# EasyEDA Pro project bipedwheel.eprj

# Schematic Schematic1
Board Name: Board1; Create Date: 2025-10-13; Page Name: P1; Project Name: bipedwheel; Schematic Name: Schematic1; Update Date: 2026-01-09; Company: 嘉立创EDA; Page Size: A4; Version: V1.0
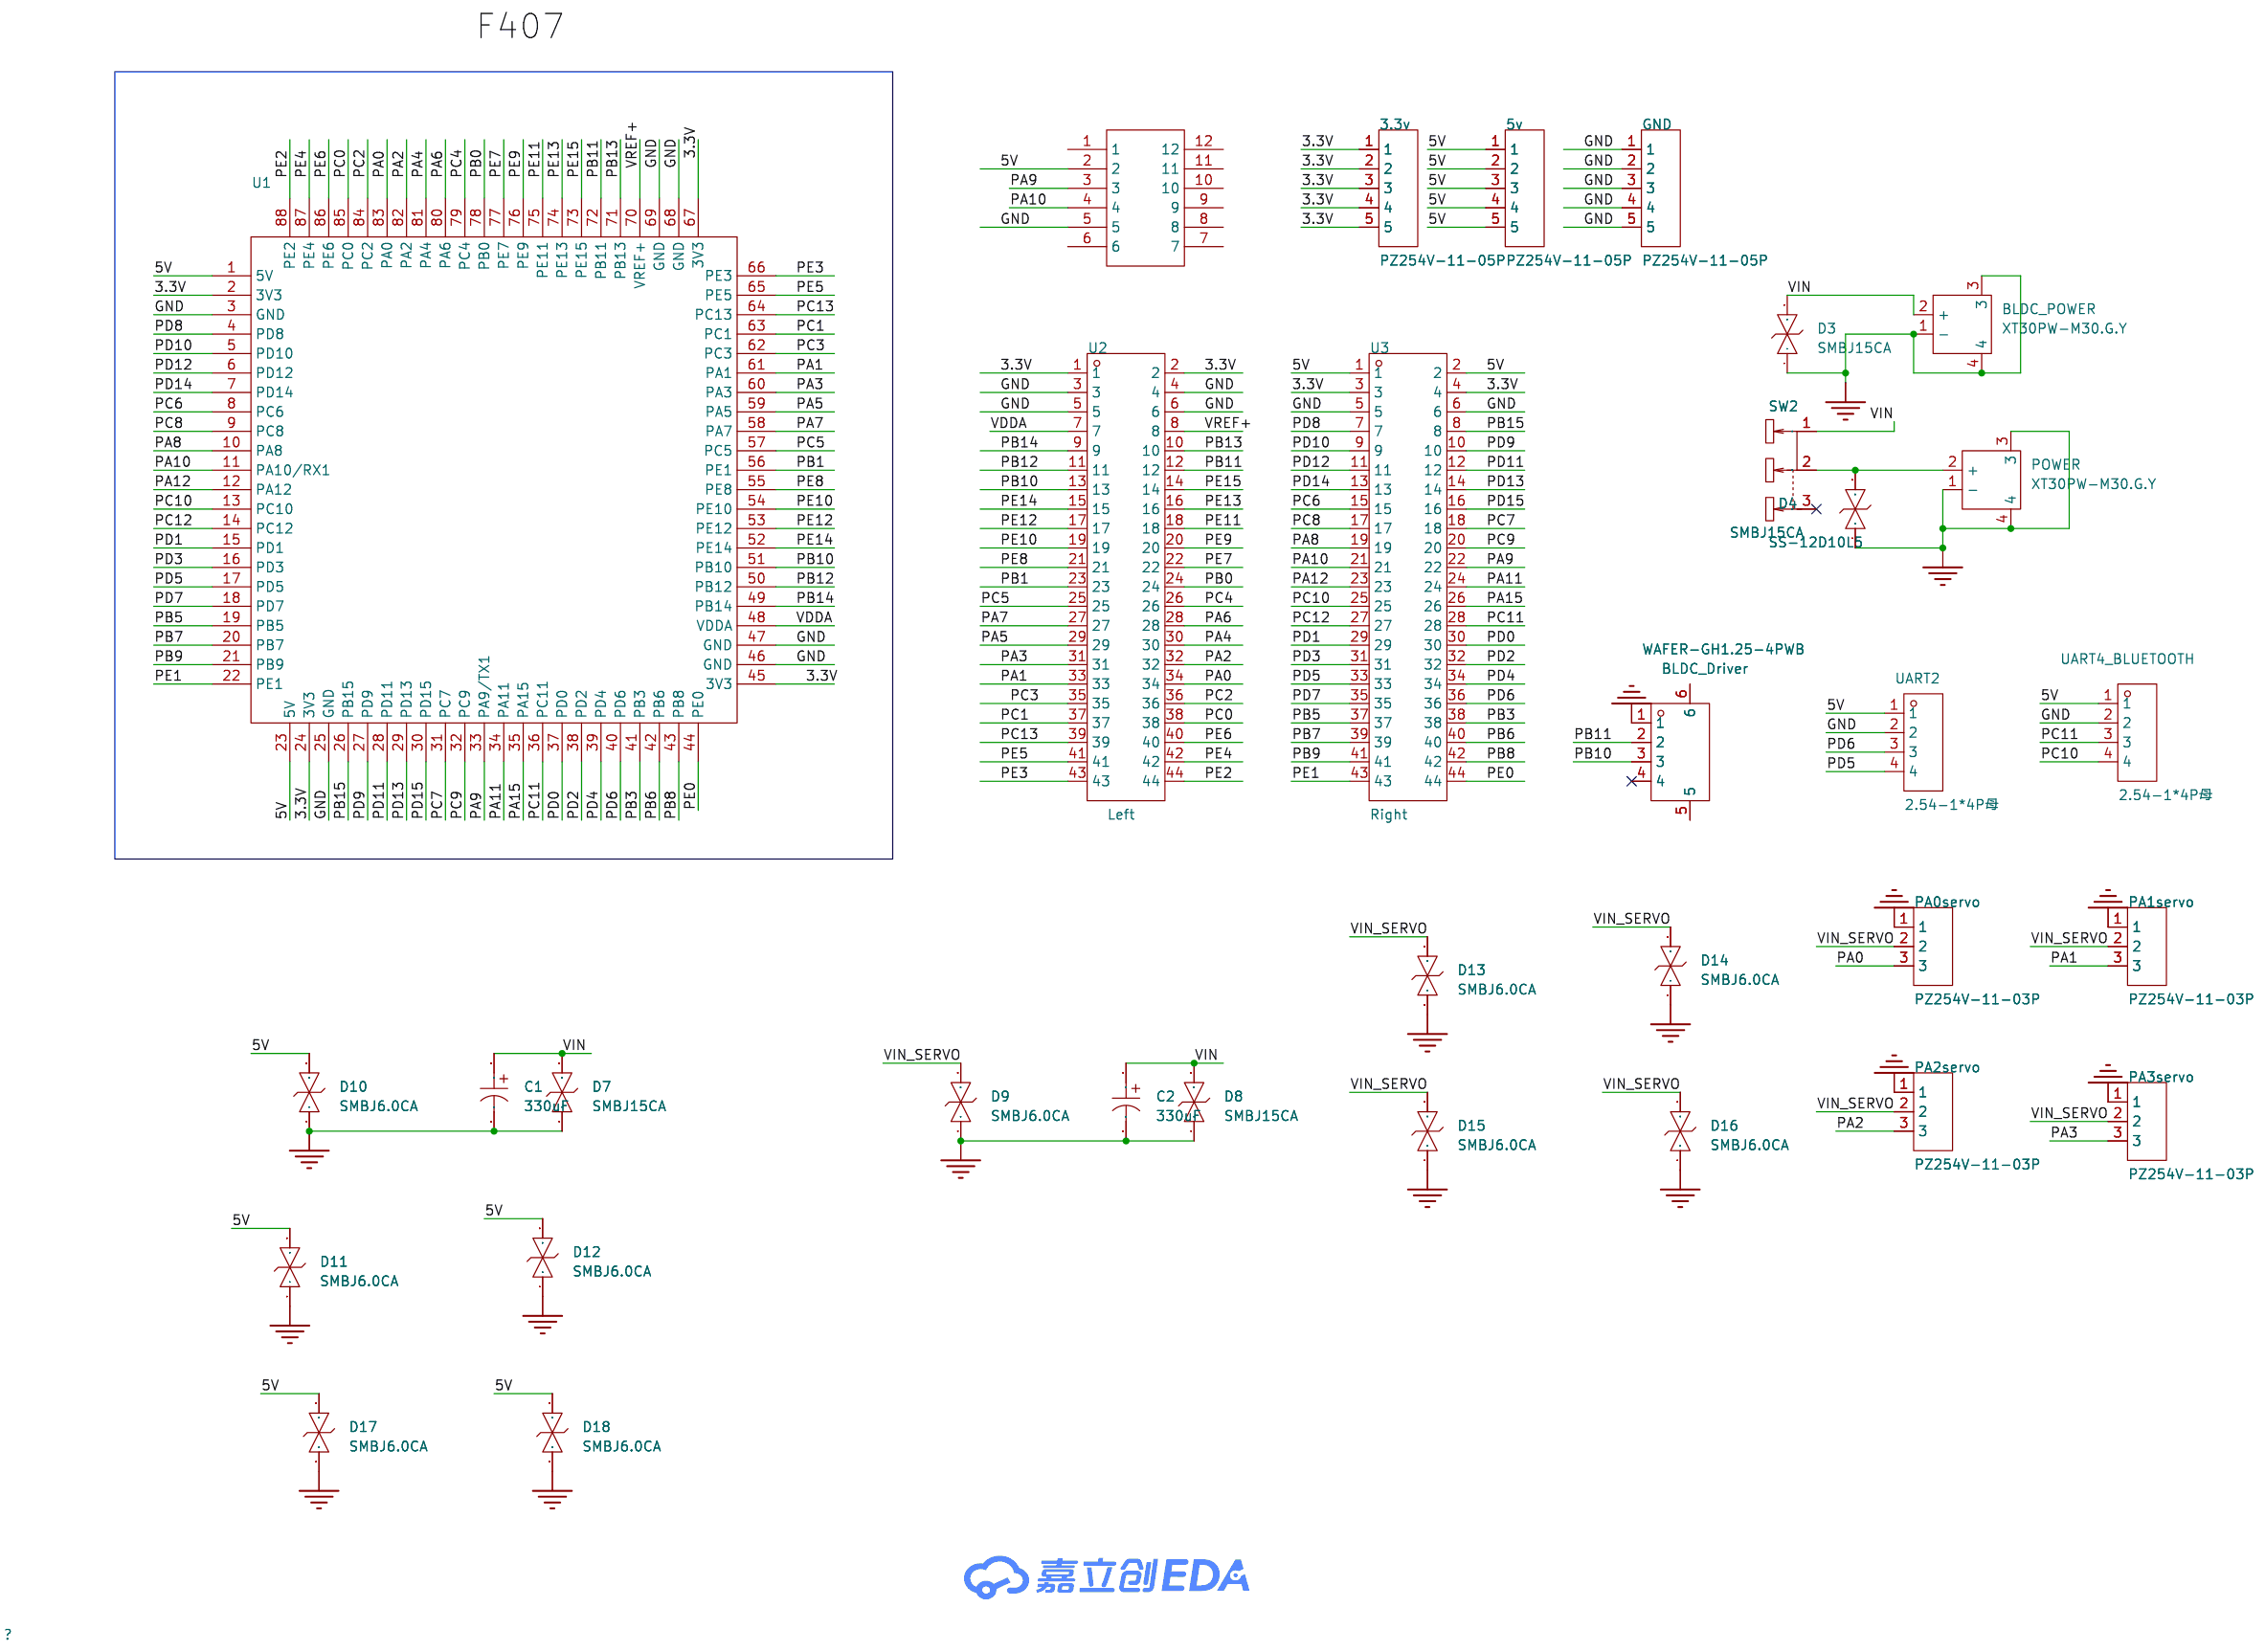
[diagram p0: schematic sheet]

## Parts
3.3v  PZ254V-11-05P  [HDR-TH_5P-P2.54-V-M]
5v  PZ254V-11-05P  [HDR-TH_5P-P2.54-V-M]
BLDC_Driver  WAFER-GH1.25-4PWB  [CONN-SMD_4P-P1.25_XUNPU_WAFER-GH1.25-4PWB]
BLDC_POWER  XT30PW-M30.G.Y  [CONN-TH_XT30PW-M]
C1  330uF  [CAP-SMD_BD6.3-L6.6-W6.6-LS7.3-FD]
C2  330uF  [CAP-SMD_BD6.3-L6.6-W6.6-LS7.3-FD]
D3  SMBJ15CA  [SMB_L4.6-W3.6-LS5.4-BI]
D4  SMBJ15CA  [SMB_L4.6-W3.6-LS5.4-BI]
D7  SMBJ15CA  [SMB_L4.6-W3.6-LS5.4-BI]
D8  SMBJ15CA  [SMB_L4.6-W3.6-LS5.4-BI]
D9  SMBJ6.0CA  [SMB_L4.6-W3.6-LS5.4-BI]
D10  SMBJ6.0CA  [SMB_L4.6-W3.6-LS5.4-BI]
D11  SMBJ6.0CA  [SMB_L4.6-W3.6-LS5.4-BI]
D12  SMBJ6.0CA  [SMB_L4.6-W3.6-LS5.4-BI]
D13  SMBJ6.0CA  [SMB_L4.6-W3.6-LS5.4-BI]
D14  SMBJ6.0CA  [SMB_L4.6-W3.6-LS5.4-BI]
D15  SMBJ6.0CA  [SMB_L4.6-W3.6-LS5.4-BI]
D16  SMBJ6.0CA  [SMB_L4.6-W3.6-LS5.4-BI]
D17  SMBJ6.0CA  [SMB_L4.6-W3.6-LS5.4-BI]
D18  SMBJ6.0CA  [SMB_L4.6-W3.6-LS5.4-BI]
GND  PZ254V-11-05P  [HDR-TH_5P-P2.54-V-M]
JY901S  -  [JY901S_插件]
PA0servo  PZ254V-11-03P  [HDR-TH_3P-P2.54-V-M]
PA1servo  PZ254V-11-03P  [HDR-TH_3P-P2.54-V-M]
PA2servo  PZ254V-11-03P  [HDR-TH_3P-P2.54-V-M]
PA3servo  PZ254V-11-03P  [HDR-TH_3P-P2.54-V-M]
POWER  XT30PW-M30.G.Y  [CONN-TH_XT30PW-M]
SW2  SS-12D10L5  [SW-TH_SS-12D10L5]
U1  -  [STM32F4XX最小系统板]
U2  Left  [HDR-TH_44P-P2.54-V-F-R2-C22-S2.54]
U3  Right  [HDR-TH_44P-P2.54-V-F-R2-C22-S2.54]
UART2  2.54-1*4P母  [HDR-TH_4P-P2.54-V-F]
UART4_BLUETOOTH  2.54-1*4P母  [HDR-TH_4P-P2.54-V-F]

## Library data of the parts
3.3v 5v GND = PZ254V-11-05P: LCSC Part Name: 1x5P 间距:2.54mm 方针 直插; Supplier Part: C492404; Manufacturer: XFCN(兴飞); Supplier Footprint: 插件,P=2.54mm; JLCPCB Part Class: 扩展库; Datasheet: https://atta.szlcsc.com/upload/public/pdf/source/20200309/C492404_E51533260F8710EFF5D4617281164C1D.pdf; Supplier: LCSC; Pin Structure: 1x5P; Pitch: 2.54mm; Circluar Pins/Square Pins: 方针; Mounting Type: 直插; Number of Rows: 单排; Number of Pins: 5P; Length of Mating Pin: 6mm; Insulation Height: 2.5mm; Length of End Connection Pin: 3mm; Contact Material: 黄铜; Operating Temperature: -40℃~+105℃; Color: 黑色
BLDC_Driver = WAFER-GH1.25-4PWB: LCSC Part Name: 1x4P 间距:1.25mm 卧贴 系列:GH; Supplier Part: C3029379; Manufacturer: XUNPU(讯普); Supplier Footprint: SMD,P=1.25mm,卧贴; JLCPCB Part Class: 扩展库; Datasheet: https://item.szlcsc.com/datasheet/WAFER-GH1.25-4PWB/3561391.html; Supplier: LCSC; Pins Structure: 1x4P; Pitch: 1.25mm; Mounting Type: 卧贴; Reference Series: GH; Number of Pins: 4P; Number of Rows: 1; Number of PINs Per Row: 4; Current Rating: 1A; Contact Material: 黄铜; Contact Plating: 锡; Operating Temperature: -25℃~+85℃; Voltage Rating: 125V; Plastic Material: LCP; Supplementary Features: 辅助焊脚; Color: 米色; Z-Height of the Board: 4.35mm; X-Length of Bottom Edge on Board (Spacing Line): 8.25mm; Y-Width of Bottom Edge on Board: 5mm
BLDC_POWER POWER = XT30PW-M30.G.Y: LCSC Part Name: AMASS(艾迈斯)航模插头 卧式弯脚 XT30PW-M公头; Supplier Part: C431092; Manufacturer: AMASS(艾迈斯); JLCPCB Part Class: 扩展库; Datasheet: https://item.szlcsc.com/datasheet/XT30PW-M30.G.Y/426930.html; Supplier: LCSC; Type: 航模插头; RatedVoltage: DC 500V; InterfaceType: 公头; RatedCurrent: 15A; RecommendedWireGauge: 16/18/20AWG; contact resistance: 1.2mΩ; specifications: 2pin
C1 C2 = JVJ25V330M6x8: LCSC Part Name: 330uF ±20% 25V; Supplier Part: C46550406; Manufacturer: JIERR(捷而瑞); Supplier Footprint: SMD,D6.3xL7.7mm; JLCPCB Part Class: 扩展库; Datasheet: https://item.szlcsc.com/datasheet/JVJ25V330M6x8/48680100.html; Supplier: LCSC; Tolerance: ±20%; Voltage Rating: 25V; Ripple Current: 200mA@120Hz; Diameter: 6.3mm; Height - Seated (Max): 7.7mm; Lifetime: 2000hrs@105℃; Operating Temperature: -55℃~+105℃
D3 D4 D7 D8 = SMBJ15CA_C19077570: LCSC Part Name: 双向TVS 15V截止 峰值浪涌电流：24.59A@10/1000us; Supplier Part: C19077570; Manufacturer: R+O(宏嘉诚); Supplier Footprint: DO-214AA(SMB); JLCPCB Part Class: Extended Part; Datasheet: https://item.szlcsc.com/datasheet/SMBJ15CA/20275655.html; Supplier: LCSC; Polarity: 双向; Reverse Stand-Off Voltage (Vrwm): 15V; Clamping Voltage: 24.4V; Peak Pulse Current (Ipp): 24.59A@10/1000us; Peak Pulse Power Dissipation (Ppp): 600W@10/1000us; Voltage - Breakdown: 18.5V; Reverse Leakage Current (Ir): 5uA; Operating Temperature: -55℃~+150℃; level of protection: IEC 61000-4-2; Type: TVS
D9-D18 = SMBJ6.0CA_C19077561: LCSC Part Name: 双向TVS 6V截止 峰值浪涌电流：58.25A@10/1000us; Supplier Part: C19077561; Manufacturer: R+O(宏嘉诚); Supplier Footprint: DO-214AA(SMB); JLCPCB Part Class: 扩展库; Datasheet: https://item.szlcsc.com/datasheet/SMBJ6.0CA/20275646.html; Supplier: LCSC; Polarity: 双向; Reverse Stand-Off Voltage (Vrwm): 6V; Clamping Voltage: 10.3V; Peak Pulse Current (Ipp): 58.25A@10/1000us; Peak Pulse Power Dissipation (Ppp): 600W@10/1000us; Voltage - Breakdown: 7.37V; Reverse Leakage Current (Ir): 800uA; Number of Channels: 单路; level of protection: IEC 61000-4-2; Type: TVS
JY901S = JY901S_插件
PA0servo PA1servo PA2servo PA3servo = PZ254V-11-03P: LCSC Part Name: 1x3P 间距:2.54mm 方针 直插; Supplier Part: C2937625; Manufacturer: XFCN(兴飞); Supplier Footprint: 插件,P=2.54mm; JLCPCB Part Class: 扩展库; Datasheet: https://item.szlcsc.com/datasheet/PZ254V-11-03P/3293280.html; Supplier: LCSC; Pin Structure: 1x3P; Pitch: 2.54mm; Circluar Pins/Square Pins: 方针; Mounting Type: 直插; Number of Rows: 单排; Number of Pins: 3P; Current Rating: 3A; Voltage Rating (Max): 250V; Length of Mating Pin: 6mm; Insulation Height: 2.5mm; Length of End Connection Pin: 3mm; Operating Temperature: -40℃~+105℃; Color: 黑色
SW2 = SS-12D10L5: LCSC Part Name: 柄长5mm 直插双档 滑动开关; Supplier Part: C319012; Manufacturer: XKB Connection(中国星坤); Supplier Footprint: 插件,13x6.8mm; JLCPCB Part Class: 扩展库; Datasheet: https://item.szlcsc.com/datasheet/SS-12D10L5/300104.html; Supplier: LCSC; Circuit: 单刀双掷; Actuator Style: 矩形柱状; Termination Style: PC引脚; Length: 13mm; Width: 6.8mm; Switch Height: 6.4mm; Mounting Type: 直插; Actuator Color: 黑色; Current Rating: 3A; Voltage Rating: 125V; Life: 1万次; Operating Temperature: -40℃~+85℃
U1 = STM32F4xx 最小系统板
U2 U3 = X6521FV-2x22-C85D32: LCSC Part Name: 间距:2.54mm 2x22P 直插; Supplier Part: C2883995; Manufacturer: XKB Connection(中国星坤); Supplier Footprint: 插件,P=2.54mm; JLCPCB Part Class: 扩展库; Datasheet: https://item.szlcsc.com/datasheet/X6521FV-2x22-C85D32/3094487.html; Supplier: LCSC; Holes Structure: 2x22P; Pitch: 2.54mm; Row Spacing: 2.54mm; Circular Hole / Square Hole: 方孔; Mounting Type: 直插; Number of Rows: 双排; Number of Positions: 44P; Current Rating: 3A; Voltage Rating (Max): 250V; Holes Direction: 顶部; Insulation Height: 8.5mm; Contact Material: 黄铜; Contact Plating: 金; Operating Temperature: -40℃~+105℃
UART2 UART4_BLUETOOTH = 2.54-1*4P母: LCSC Part Name: 间距:2.54mm 1x4P 直插; Supplier Part: C2718488; Manufacturer: BOOMELE(博穆精密); Supplier Footprint: 插件,P=2.54mm; JLCPCB Part Class: 扩展库; Datasheet: https://item.szlcsc.com/datasheet/2.54-1*4P%25E6%25AF%258D/2834502.html; Supplier: LCSC; Holes Structure: 1x4P; Pitch: 2.54mm; Circular Hole / Square Hole: 方孔; Mounting Type: 直插; Number of Rows: 单排; Number of Positions: 4P; Current Rating: 3A; Holes Direction: 顶部; Contact Material: 青铜; Operating Temperature: -40℃~+105℃

## Nets
3.3V: 3.3v.1 3.3v.2 3.3v.3 3.3v.4 3.3v.5 U1.2(3V3) U1.24(3V3) U1.45(3V3) U1.67(3V3) U2.1 U2.2 U3.3 U3.4
5V: 5v.1 5v.2 5v.3 5v.4 5v.5 D10.2 D11.2 D12.2 D17.2 D18.2 JY901S.2 U1.1(5V) U1.23(5V) U3.1 U3.2 UART2.1 UART4_BLUETOOTH.1
GND: BLDC_Driver.1 BLDC_POWER.1(-) BLDC_POWER.3 BLDC_POWER.4 C1.2 C2.2 D3.1 D4.1 D7.1 D8.1 D9.1 D10.1 D11.1 D12.1 D13.1 D14.1 D15.1 D16.1 D17.1 D18.1 GND.1 GND.2 GND.3 GND.4 GND.5 JY901S.5 PA0servo.1 PA1servo.1 PA2servo.1 PA3servo.1 POWER.1(-) POWER.3 POWER.4 U1.3(GND) U1.25(GND) U1.46(GND) U1.47(GND) U1.68(GND) U1.69(GND) U2.3 U2.4 U2.5 U2.6 U3.5 U3.6 UART2.2 UART4_BLUETOOTH.2
VDDA: U1.48(VDDA) U2.7
VIN: BLDC_POWER.2(+) C1.1 C2.1 D3.2 D7.2 D8.2 SW2.1
VIN_SERVO: D9.2 D13.2 D14.2 D15.2 D16.2 PA0servo.2 PA1servo.2 PA2servo.2 PA3servo.2
PA0: PA0servo.3 U1.83(PA0) U2.34
PA1: PA1servo.3 U1.61(PA1) U2.33
PA2: PA2servo.3 U1.82(PA2) U2.32
PA3: PA3servo.3 U1.60(PA3) U2.31
PA4: U1.81(PA4) U2.30
PA5: U1.59(PA5) U2.29
PA6: U1.80(PA6) U2.28
PA7: U1.58(PA7) U2.27
PA8: U1.10(PA8) U3.19
PA9: JY901S.3 U1.33(PA9/TX1) U3.22
PA10: JY901S.4 U1.11(PA10/RX1) U3.21
PA11: U1.34(PA11) U3.24
PA12: U1.12(PA12) U3.23
PA15: U1.35(PA15) U3.26
PB0: U1.78(PB0) U2.24
PB1: U1.56(PE1) U2.23
PB3: U1.41(PB3) U3.38
PB5: U1.19(PB5) U3.37
PB6: U1.42(PB6) U3.40
PB7: U1.20(PB7) U3.39
PB8: U1.43(PB8) U3.42
PB9: U1.21(PB9) U3.41
PB10: BLDC_Driver.3 U1.51(PB10) U2.13
PB11: BLDC_Driver.2 U1.72(PB11) U2.12
PB12: U1.50(PB12) U2.11
PB13: U1.71(PB13) U2.10
PB14: U1.49(PB14) U2.9
PB15: U1.26(PB15) U3.8
PC0: U1.85(PC0) U2.38
PC1: U1.63(PC1) U2.37
PC2: U1.84(PC2) U2.36
PC3: U1.62(PC3) U2.35
PC4: U1.79(PC4) U2.26
PC5: U1.57(PC5) U2.25
PC6: U1.8(PC6) U3.15
PC7: U1.31(PC7) U3.18
PC8: U1.9(PC8) U3.17
PC9: U1.32(PC9) U3.20
PC10: U1.13(PC10) U3.25 UART4_BLUETOOTH.4
PC11: U1.36(PC11) U3.28 UART4_BLUETOOTH.3
PC12: U1.14(PC12) U3.27
PC13: U1.64(PC13) U2.39
PD0: U1.37(PD0) U3.30
PD1: U1.15(PD1) U3.29
PD2: U1.38(PD2) U3.32
PD3: U1.16(PD3) U3.31
PD4: U1.39(PD4) U3.34
PD5: U1.17(PD5) U3.33 UART2.4
PD6: U1.40(PD6) U3.36 UART2.3
PD7: U1.18(PD7) U3.35
PD8: U1.4(PD8) U3.7
PD9: U1.27(PD9) U3.10
PD10: U1.5(PD10) U3.9
PD11: U1.28(PD11) U3.12
PD12: U1.6(PD12) U3.11
PD13: U1.29(PD13) U3.14
PD14: U1.7(PD14) U3.13
PD15: U1.30(PD15) U3.16
PE0: U1.44(PE0) U3.44
PE1: U1.22(PE1) U3.43
PE2: U1.88(PE2) U2.44
PE3: U1.66(PE3) U2.43
PE4: U1.87(PE4) U2.42
PE5: U1.65(PE5) U2.41
PE6: U1.86(PE6) U2.40
PE7: U1.77(PE7) U2.22
PE8: U1.55(PE8) U2.21
PE9: U1.76(PE9) U2.20
PE10: U1.54(PE10) U2.19
PE11: U1.75(PE11) U2.18
PE12: U1.53(PE12) U2.17
PE13: U1.74(PE13) U2.16
PE14: U1.52(PE14) U2.15
PE15: U1.73(PE15) U2.14
VREF+: U1.70(VREF+) U2.8
$1N12600: D4.2 POWER.2(+) SW2.2

Not connected (* = marked no-connect by the designer): BLDC_Driver 4* 5 6; JY901S 1 6 7 8 9 10 11 12; SW2 3*

## Notes on the sheet
- F407

# Board PCB1
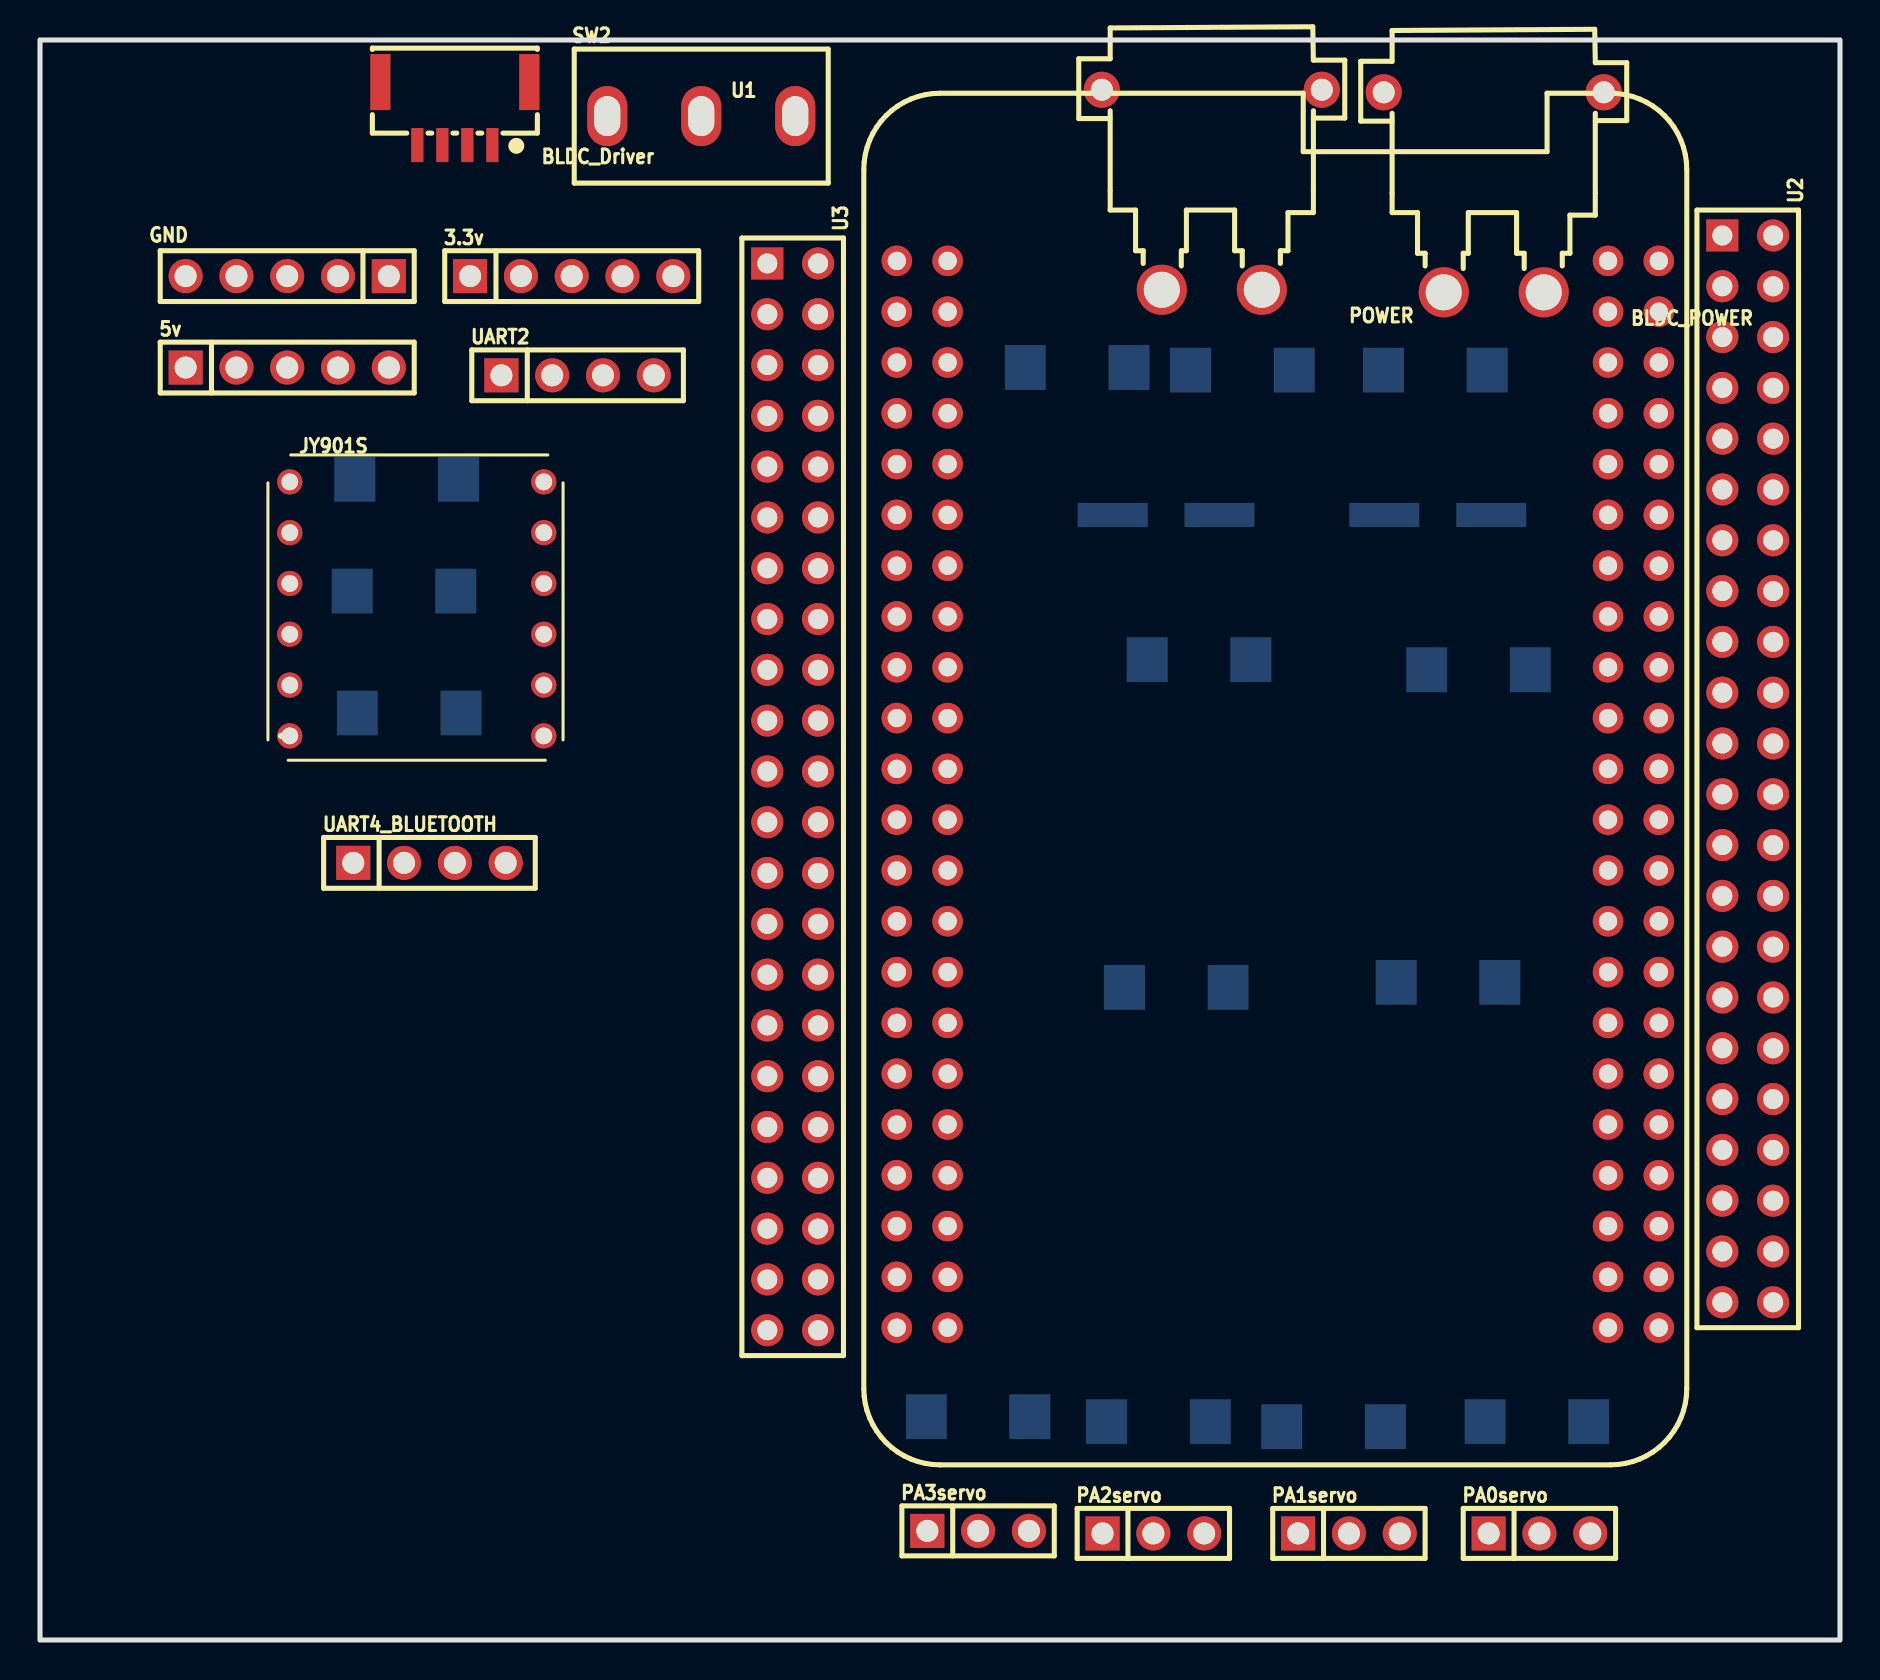
[diagram p1: board, top side]
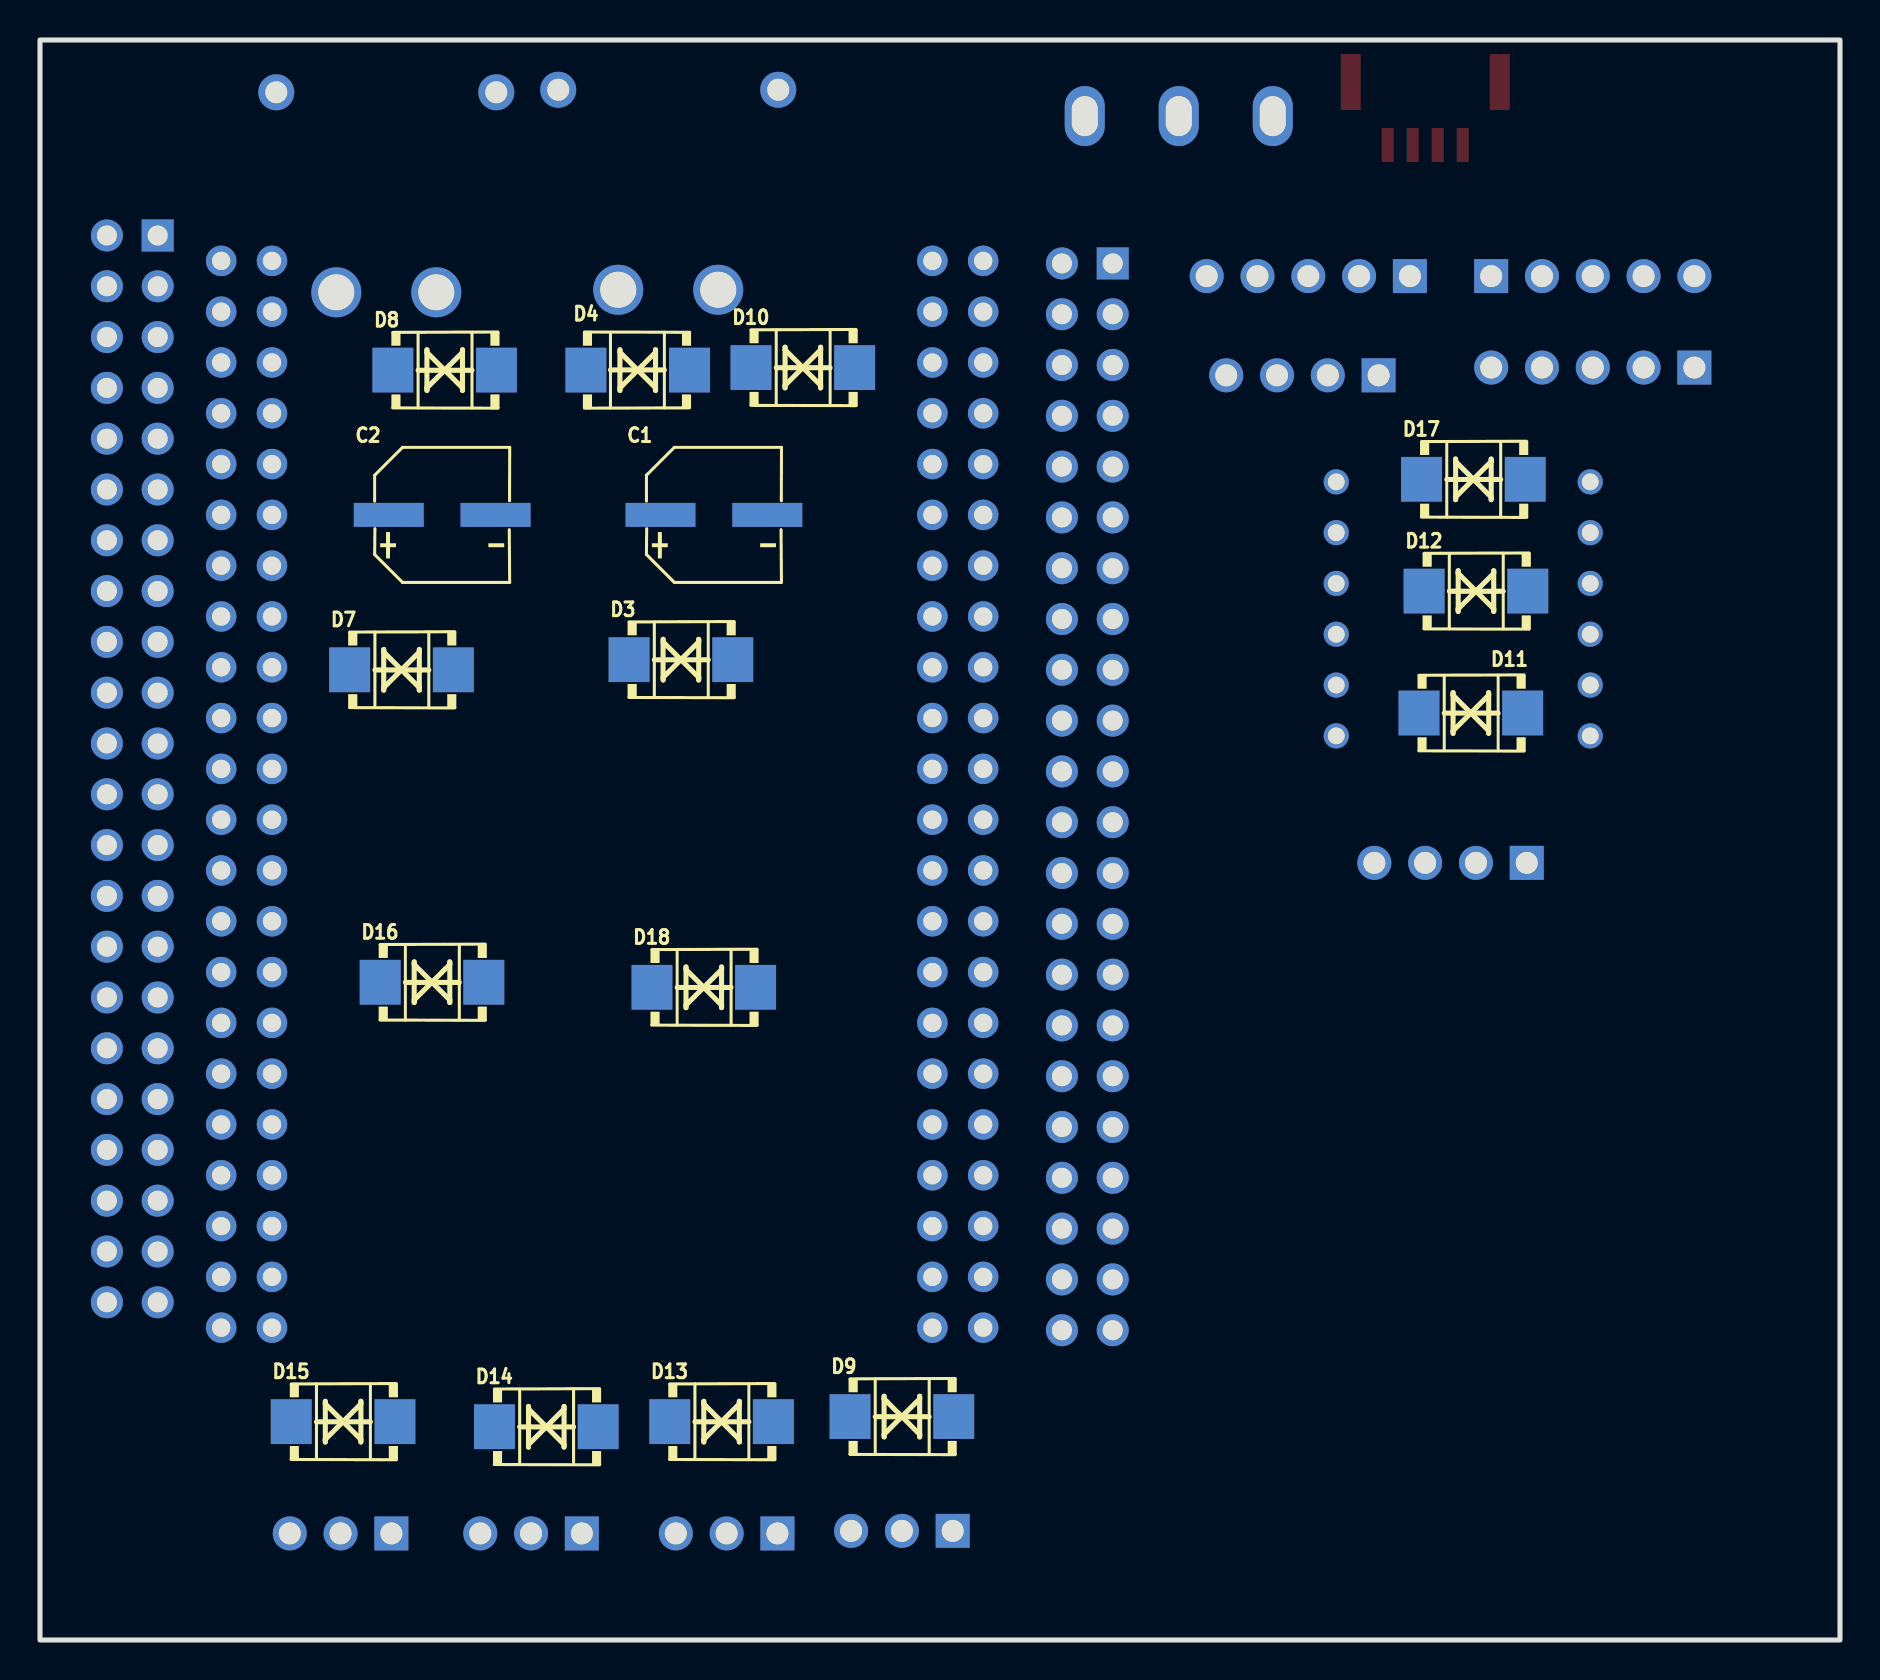
[diagram p2: board, bottom side, seen from below]

Outline 90 x 80 mm; copper layers: Top Layer, Inner1, Inner2, Bottom Layer. Coordinates in mm from the lower left corner of the outline.
Outline path: rectangle 0,80 90,0
Stack: Top Layer 0.035mm 外层铜厚1oz / Dielectric1 0.2104mm 7628 RC49% 8.6mil / Inner1 0.0152mm 内层铜厚 / Dielectric2 1.065mm 1.1mm H/HOZ Copper / Inner2 0.0152mm 内层铜厚 / Dielectric3 0.2104mm 7628 RC49% 8.6mil / Bottom Layer 0.035mm 外层铜厚1oz

## Design rules (mm)
template: 自定义配置
spacing copperThickness1oz (default): track to track 0.102, other pairs 0.152 to 0.3
spacing copperThickness2oz: track to track 0.203, other pairs 0.152 to 0.3
track width copperThickness1oz (default): min 0.127, default 0.254, max 2.54
track width copperThickness2oz: min 0.203, default 0.254, max 2.54
differential pair differentialPair (default): width min 0.127, default 0.254, max 2.54; gap min 0.152, default 0.152
via viaSize (default): diameter min 0.5, default 0.61, max 10; hole min 0.3, default 0.305, max 6.3
net 3.3V uses copperRegion2
net 5V uses copperRegion2
net GND uses copperRegion2
net VIN uses copperRegion2
net VIN_SERVO uses copperRegion2

## Placement (name value [footprint] x y rotation side)
3.3v  PZ254V-11-05P  [HDR-TH_5P-P2.54-V-M]  26.59 68.19 0 top
5v  PZ254V-11-05P  [HDR-TH_5P-P2.54-V-M]  12.36 63.62 0 top
BLDC_Driver  WAFER-GH1.25-4PWB  [CONN-SMD_4P-P1.25_XUNPU_WAFER-GH1.25-4PWB]  20.74 76.32 180 top
BLDC_POWER  XT30PW-M30.G.Y  [CONN-TH_XT30PW-M]  72.69 72.39 180 top
C1  330uF  [CAP-SMD_BD6.3-L6.6-W6.6-LS7.3-FD]  56.3 56.26 180 bottom
C2  330uF  [CAP-SMD_BD6.3-L6.6-W6.6-LS7.3-FD]  69.89 56.26 180 bottom
D3  SMBJ15CA  [SMB_L4.6-W3.6-LS5.4-BI]  57.95 49.02 180 bottom
D4  SMBJ15CA  [SMB_L4.6-W3.6-LS5.4-BI]  60.11 63.5 0 bottom
D7  SMBJ15CA  [SMB_L4.6-W3.6-LS5.4-BI]  71.92 48.51 180 bottom
D8  SMBJ15CA  [SMB_L4.6-W3.6-LS5.4-BI]  69.76 63.5 180 bottom
D9  SMBJ6.0CA  [SMB_L4.6-W3.6-LS5.4-BI]  46.91 11.17 180 bottom
D10  SMBJ6.0CA  [SMB_L4.6-W3.6-LS5.4-BI]  51.86 63.62 180 bottom
D11  SMBJ6.0CA  [SMB_L4.6-W3.6-LS5.4-BI]  18.46 46.35 180 bottom
D12  SMBJ6.0CA  [SMB_L4.6-W3.6-LS5.4-BI]  18.2 52.45 180 bottom
D13  SMBJ6.0CA  [SMB_L4.6-W3.6-LS5.4-BI]  55.92 10.92 180 bottom
D14  SMBJ6.0CA  [SMB_L4.6-W3.6-LS5.4-BI]  64.69 10.66 180 bottom
D15  SMBJ6.0CA  [SMB_L4.6-W3.6-LS5.4-BI]  74.84 10.92 180 bottom
D16  SMBJ6.0CA  [SMB_L4.6-W3.6-LS5.4-BI]  70.4 32.89 180 bottom
D17  SMBJ6.0CA  [SMB_L4.6-W3.6-LS5.4-BI]  18.33 58.03 180 bottom
D18  SMBJ6.0CA  [SMB_L4.6-W3.6-LS5.4-BI]  56.81 32.63 180 bottom
GND  PZ254V-11-05P  [HDR-TH_5P-P2.54-V-M]  12.36 68.19 180 top
JY901S  -  [JY901S_插件]  18.84 51.43 0 top
PA0servo  PZ254V-11-03P  [HDR-TH_3P-P2.54-V-M]  74.97 5.33 0 top
PA1servo  PZ254V-11-03P  [HDR-TH_3P-P2.54-V-M]  65.45 5.33 0 top
PA2servo  PZ254V-11-03P  [HDR-TH_3P-P2.54-V-M]  55.67 5.33 0 top
PA3servo  PZ254V-11-03P  [HDR-TH_3P-P2.54-V-M]  46.91 5.46 0 top
POWER  XT30PW-M30.G.Y  [CONN-TH_XT30PW-M]  58.59 72.51 180 top
SW2  SS-12D10L5  [SW-TH_SS-12D10L5]  33.06 76.19 0 top
U1  -  [STM32F4XX最小系统板]  42.84 68.96 0 top
U2  Left  [HDR-TH_44P-P2.54-V-F-R2-C22-S2.54]  85.39 43.56 270 top
U3  Right  [HDR-TH_44P-P2.54-V-F-R2-C22-S2.54]  37.63 42.16 270 top
UART2  2.54-1*4P母  [HDR-TH_4P-P2.54-V-F]  26.88 63.23 0 top
UART4_BLUETOOTH  2.54-1*4P母  [HDR-TH_4P-P2.54-V-F]  19.47 38.86 0 top

## Footprints (pads in the part's own frame, mm; a bottom-side part is the same pattern mirrored in y, then rotated)
CAP-SMD_BD6.3-L6.6-W6.6-LS7.3-FD
  rect 3.5x1.2 smd: 1(-2.67,0) 2(2.67,0)
CONN-SMD_4P-P1.25_XUNPU_WAFER-GH1.25-4PWB
  rect 0.6x1.7 smd: 1(-1.875,1.575) 2(-0.625,1.575) 3(0.625,1.575) 4(1.875,1.575)
  rect 1x2.8 smd: 5(3.725,-1.575) 6(-3.725,-1.575)
CONN-TH_XT30PW-M
  round 2.5 hole 1.8: 1(-2.5,5) 2(2.5,5)
  round 1.8 hole 1.1: 3(5.5,-5) 4(-5.5,-5)
HDR-TH_3P-P2.54-V-M
  rect 1.7x1.7 hole 1.1: 1(-2.54,0)
  round 1.7 hole 1.1: 2(0,0) 3(2.54,0)
HDR-TH_4P-P2.54-V-F
  rect 1.7x1.7 hole 1.1: 1(-3.81,0)
  round 1.7 hole 1.1: 2(-1.27,0) 3(1.27,0) 4(3.81,0)
HDR-TH_5P-P2.54-V-M
  rect 1.7x1.7 hole 1.1: 1(-5.08,0)
  round 1.7 hole 1.1: 2(-2.54,0) 3(0,0) 4(2.54,0) 5(5.08,0)
HDR-TH_44P-P2.54-V-F-R2-C22-S2.54
  rect 1.6x1.6 hole 1: 1(-26.67,-1.27)
  round 1.6 hole 1: 2(-26.67,1.27) 3(-24.13,-1.27) 4(-24.13,1.27) 5(-21.59,-1.27) 6(-21.59,1.27) 7(-19.05,-1.27) 8(-19.05,1.27) 9(-16.51,-1.27) 10(-16.51,1.27) 11(-13.97,-1.27) 12(-13.97,1.27) 13(-11.43,-1.27) 14(-11.43,1.27) 15(-8.89,-1.27) 16(-8.89,1.27) 17(-6.35,-1.27) 18(-6.35,1.27) 19(-3.81,-1.27) 20(-3.81,1.27) 21(-1.27,-1.27) 22(-1.27,1.27) 23(1.27,-1.27) 24(1.27,1.27) 25(3.81,-1.27) 26(3.81,1.27) 27(6.35,-1.27) 28(6.35,1.27) 29(8.89,-1.27) 30(8.89,1.27) 31(11.43,-1.27) 32(11.43,1.27) 33(13.97,-1.27) 34(13.97,1.27) 35(16.51,-1.27) 36(16.51,1.27) 37(19.05,-1.27) 38(19.05,1.27) 39(21.59,-1.27) 40(21.59,1.27) 41(24.13,-1.27) 42(24.13,1.27) 43(26.67,-1.27) 44(26.67,1.27)
JY901S_插件
  round 1.26 hole 0.84: 1(-6.35,6.477) 2(-6.35,3.937) 3(-6.35,1.397) 4(-6.35,-1.143) 5(-6.35,-3.683) 6(-6.35,-6.223) 7(6.35,-6.223) 8(6.35,-3.683) 9(6.35,-1.143) 10(6.35,1.397) 11(6.35,3.937) 12(6.35,6.477)
SMB_L4.6-W3.6-LS5.4-BI
  rect 2.047x2.241 smd: 1(-2.591,0) 2(2.591,0)
STM32F4XX最小系统板
  round 1.524 hole 0.914: 1(0,0) 2(0,-2.54) 3(0,-5.08) 4(0,-7.62) 5(0,-10.16) 6(0,-12.7) 7(0,-15.24) 8(0,-17.78) 9(0,-20.32) 10(0,-22.86) 11(0,-25.4) 12(0,-27.94) 13(0,-30.48) 14(0,-33.02) 15(0,-35.56) 16(0,-38.1) 17(0,-40.64) 18(0,-43.18) 19(0,-45.72) 20(0,-48.26) 21(0,-50.8) 22(0,-53.34) 23(2.54,0) 24(2.54,-2.54) 25(2.54,-5.08) 26(2.54,-7.62) 27(2.54,-10.16) 28(2.54,-12.7) 29(2.54,-15.24) 30(2.54,-17.78) 31(2.54,-20.32) 32(2.54,-22.86) 33(2.54,-25.4) 34(2.54,-27.94) 35(2.54,-30.48) 36(2.54,-33.02) 37(2.54,-35.56) 38(2.54,-38.1) 39(2.54,-40.64) 40(2.54,-43.18) 41(2.54,-45.72) 42(2.54,-48.26) 43(2.54,-50.8) 44(2.54,-53.34) 45(35.56,0) 46(35.56,-2.54) 47(35.56,-5.08) 48(35.56,-7.62) 49(35.56,-10.16) 50(35.56,-12.7) 51(35.56,-15.24) 52(35.56,-17.78) 53(35.56,-20.32) 54(35.56,-22.86) 55(35.56,-25.4) 56(35.56,-27.94) 57(35.56,-30.48) 58(35.56,-33.02) 59(35.56,-35.56) 60(35.56,-38.1) 61(35.56,-40.64) 62(35.56,-43.18) 63(35.56,-45.72) 64(35.56,-48.26) 65(35.56,-50.8) 66(35.56,-53.34) 67(38.1,0) 68(38.1,-2.54) 69(38.1,-5.08) 70(38.1,-7.62) 71(38.1,-10.16) 72(38.1,-12.7) 73(38.1,-15.24) 74(38.1,-17.78) 75(38.1,-20.32) 76(38.1,-22.86) 77(38.1,-25.4) 78(38.1,-27.94) 79(38.1,-30.48) 80(38.1,-33.02) 81(38.1,-35.56) 82(38.1,-38.1) 83(38.1,-40.64) 84(38.1,-43.18) 85(38.1,-45.72) 86(38.1,-48.26) 87(38.1,-50.8) 88(38.1,-53.34)
SW-TH_SS-12D10L5
  oval 2x3 hole 1.3x2: 1(-4.7,0) 2(0,0) 3(4.7,0)

## Nets
As in the schematic.

Pads without a net: BLDC_Driver 4 5 6; JY901S 1 6 7 8 9 10 11 12; SW2 3
